# Altium schematic sheet hm10.SchDoc
size A4
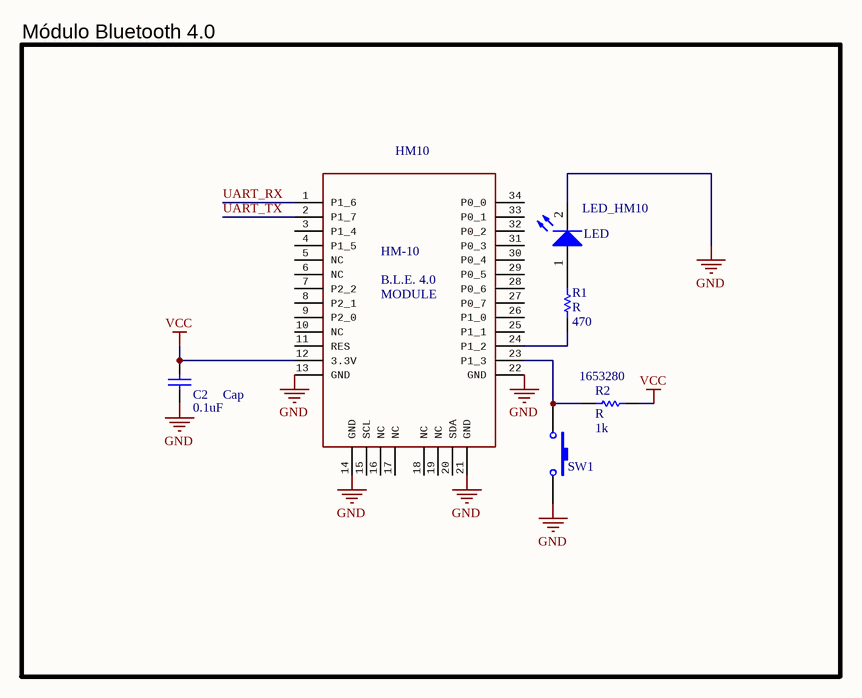
[diagram p0: hm10.SchDoc]

## Parts
C2  Cap  value 0.1uF  [0805]
HM10  HM-10 Module  [HM-10 module]  (value not drawn)
LED_HM10  LED  [0603 LED-RED]
R1  R  value 470  [0805 RES]
R2  R  value 1k  Supplier Part Number 1: 1653280  [0805 RES]
SW1  Pulsador  [B3U-1000P]  (value not drawn)

## Blocks framed on the sheet
Módulo Bluetooth 4.0: C2 HM10 LED_HM10 R1 R2 SW1

## Nets
GND: C2.1 HM10.13(GND) HM10.14(GND) HM10.21(GND) HM10.22(GND) LED_HM10.2(C) SW1.2
VCC: C2.2 HM10.12(3.3V) R2.2
UART_RX: HM10.1(P1_6)
UART_TX: HM10.2(P1_7)
NetHM10_23: HM10.23(P1_3) R2.1 SW1.1
NetHM10_24: HM10.24(P1_2) R1.2
NetLED_HM10_1: LED_HM10.1(A) R1.1

Not connected (* = marked no-connect by the designer): HM10 3(P1_4) 4(P1_5) 5(NC) 6(NC) 7(P2_2) 8(P2_1) 9(P2_0) 10(NC) 11(RES) 15(SCL) 16(NC) 17(NC) 18(NC) 19(NC) 20(SDA) 25(P1_1) 26(P1_0) 27(P0_7) 28(P0_6) 29(P0_5) 30(P0_4) 31(P0_3) 32(P0_2) 33(P0_1) 34(P0_0)

## Notes on the sheet
- (in symbol HM-10 Module) HM-10; B.L.E. 4.0; MODULE

## Library data of the parts
C2 = Cap: Capacitor; Published: 8-Jun-2000; LatestRevisionDate: 17-Jul-2002; LatestRevisionNote: Re-released for DXP Platform.; PackageReference: RAD-0.3; Publisher: Altium Limited; PackageDescription: Radial Cap, Thru-Hole; 2 Leads; 0.3 in Pin Spacing
R1 R2 = R: Resistor; Manufacturer: Generic Components; Class: Passive; Published: 08/06/2000; Publisher: Altium Hobart Technology Centre; SubClass: Resistor
  R2: Supplier 1: Farnell
SW1 = Pulsador_1: Switch; Manufacturer: Generic Components; Published: 1999